# EAGLE board dig_usb (EAGLE 6.6.0)
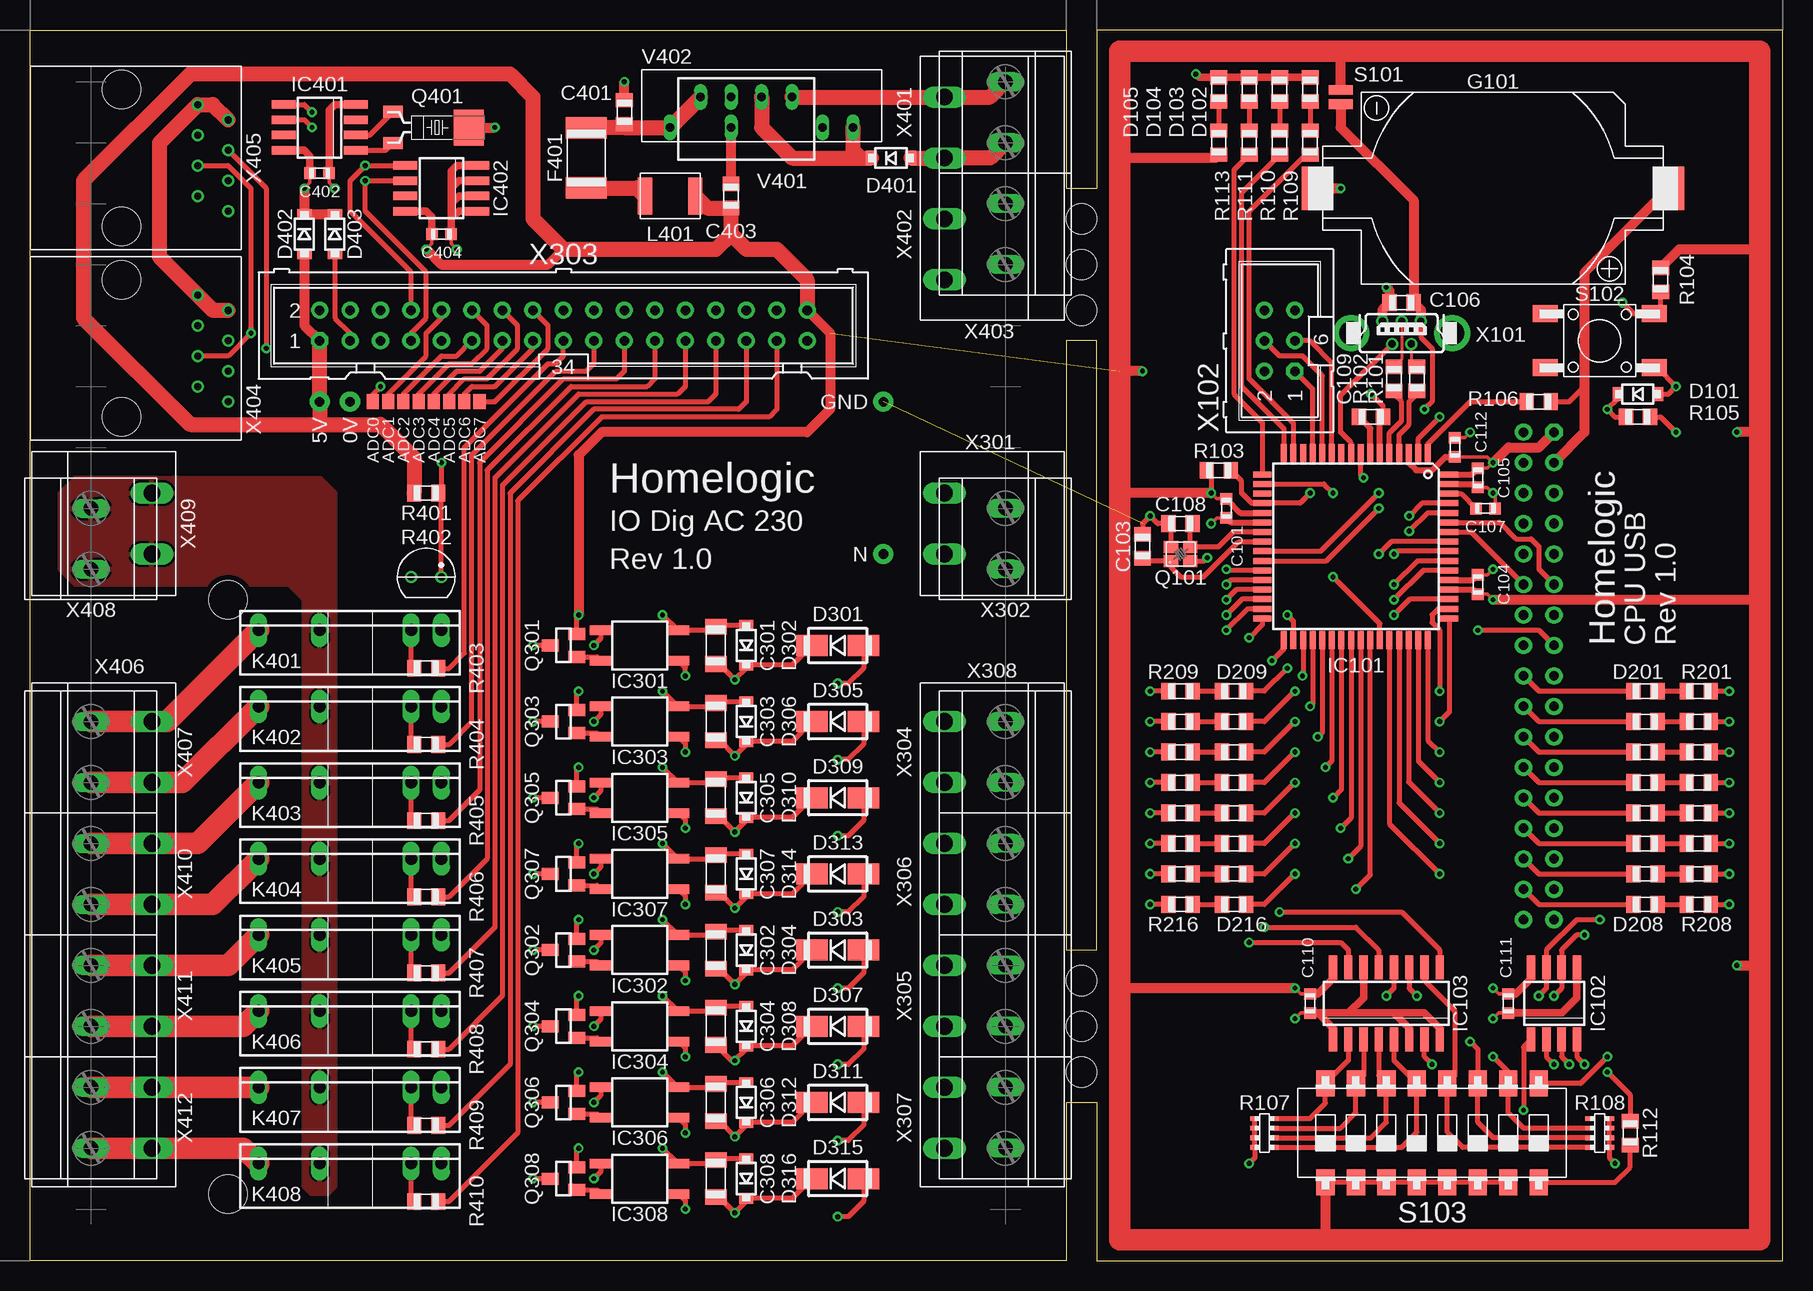
[diagram p4: board, top side]
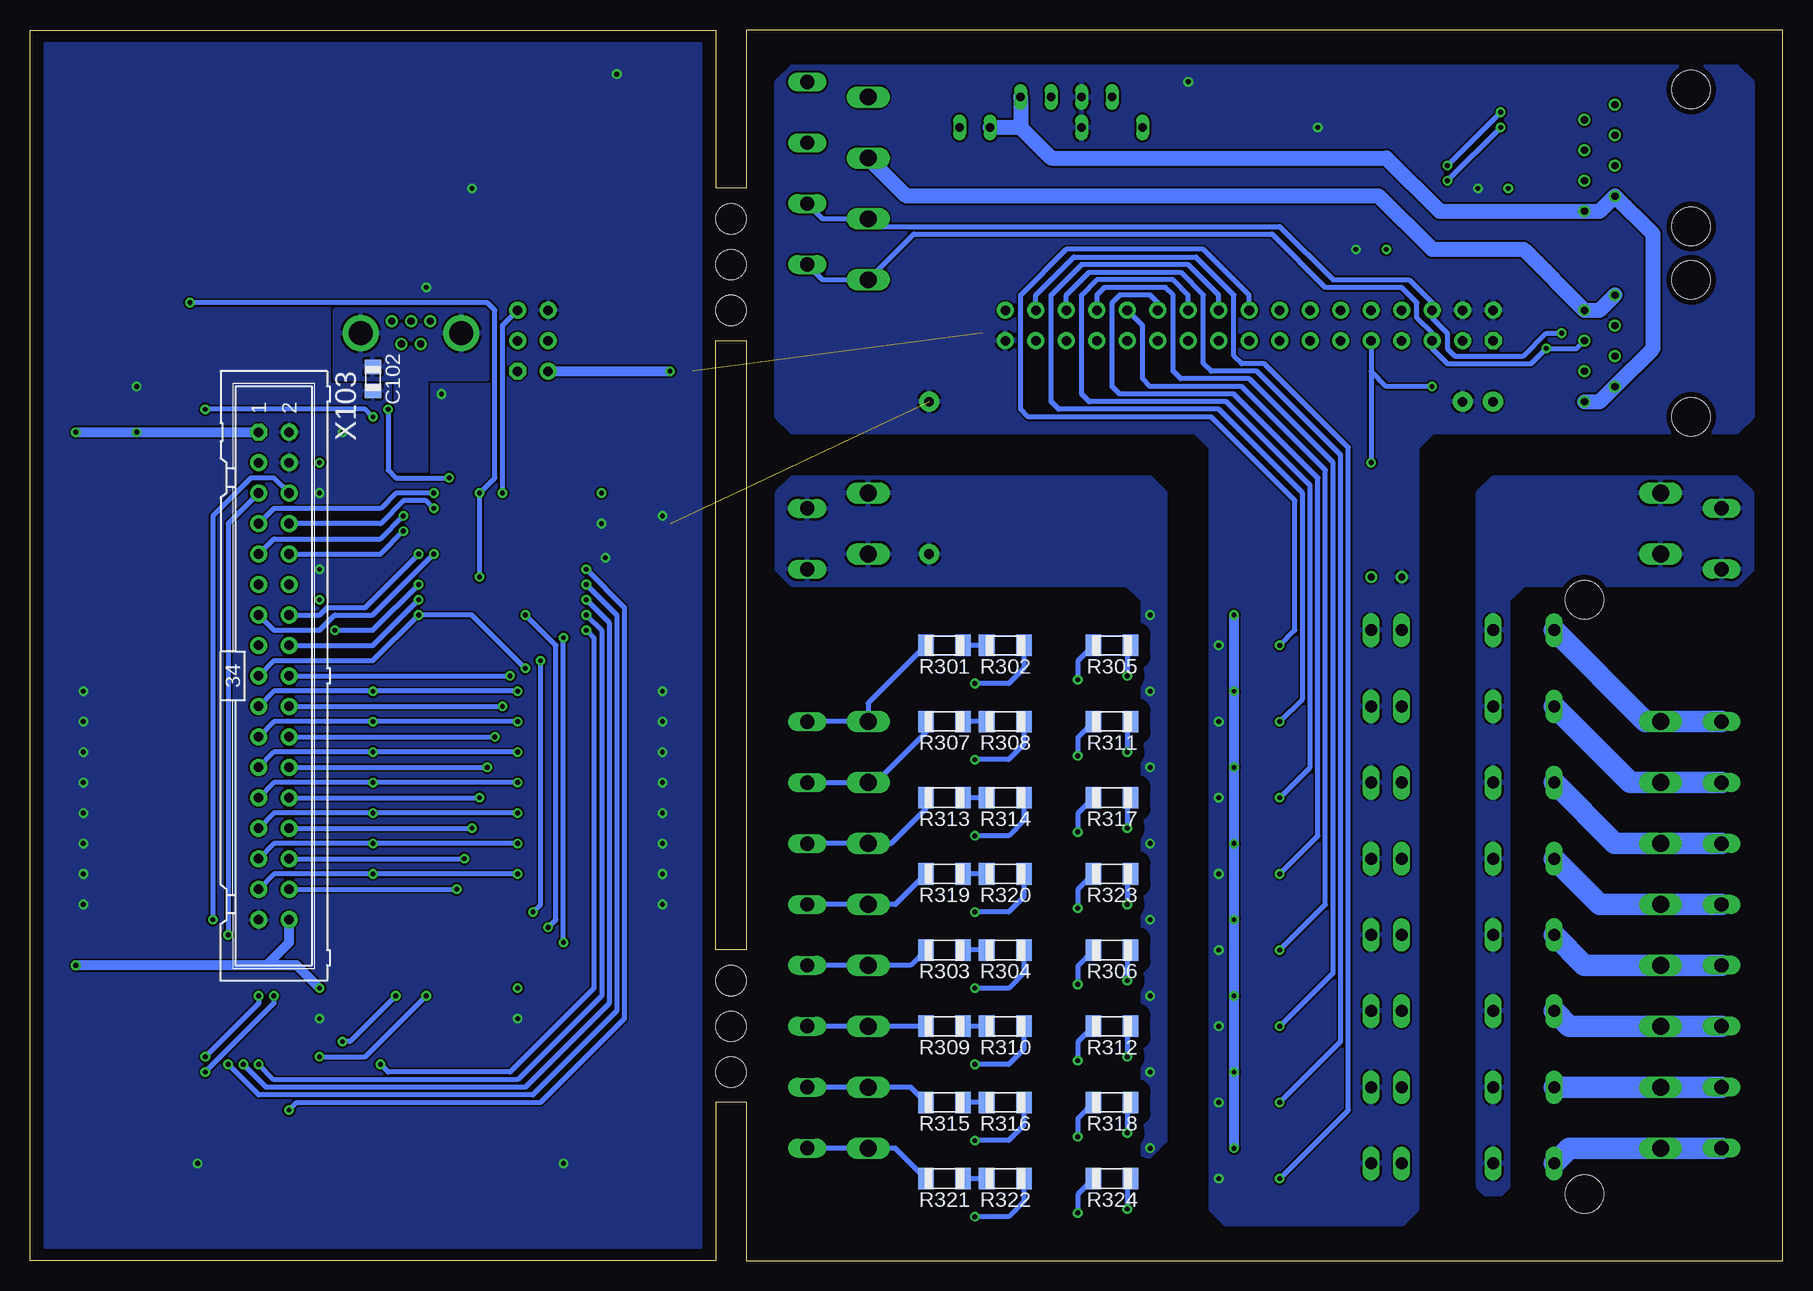
[diagram p5: board, bottom side, seen from below]

Size 146.05 x 102.62 mm. Coordinates in mm from the lower left corner, seen from the top.
Outline: 0,0 0,102.62 86.36,102.62 86.36,89.41 88.9,89.41 88.9,102.62 146.05,102.62 146.05,0 88.9,0 88.9,13.21 86.36,13.21 86.36,0 0,0
Copper layers (1*16): Top 0.018mm / dielectric 1.55mm / Bottom 0.018mm
Design rules "eC-PCB_proto-2-layer *": minimum track width 0.15mm, minimum drill 0.25mm, track to track 0.15mm, track to pad 0.15mm, pad to pad 0.15mm, via to via 0.15mm, smd to smd 0.15mm, copper to edge 0.45mm, drill to drill 0.3mm, minimum pad ring 0.2mm, minimum via ring 0.2mm, stop-mask expansion 0.1mm, vias tented up to drill 0.5mm, thermal gap 0.2mm
Net classes: 1 netz: clearance 3 mm to class 0, clearance 1 mm; 2 buspower: clearance 0.5 mm to class 0, clearance 3 mm to class 1, clearance 0.5 mm
Holes 2.5 mm at 87.63,15.75 87.63,19.56 87.63,23.37 87.63,86.87 87.63,83.06 87.63,79.25
Holes 3.2 mm at 16.51,5.59 16.51,55.12
tKeepout: area 12.7,0 to 14,102.6; area 72.4,0 to 73.7,102.6; area 88.9,0 to 97.8,102.6; area 88.9,0 to 146.1,3; area 88.9,99.6 to 146.1,102.6; area 137.2,0 to 146.1,102.6
bKeepout: area 0,0 to 86.4,3; area 0,99.6 to 86.4,102.6; area 0,0 to 2.5,102.6; area 83.8,0 to 86.4,102.6; area 88.9,99.6 to 146.1,102.6; area 88.9,0 to 146.1,3
Milling: area 86.4,25.9 to 88.9,76.7

## Footprints (pad centres in the part's own frame; a part is rotated, then mirrored left to right if it is on the bottom)
VIA08 = drill 0.8 pad 1.676: 1 0,0
PADS = smd 1.27 x 1.016: 1 0,0
CHIP_0603 = smd 0.95 x 1: 1 -0.8,0; 2 0.8,0
CHIP_0805 = smd 1.2 x 1.4: 1 -1,0; 2 1,0
CHIP_1206 = smd 1.3 x 1.8: 1 -1.55,0; 2 1.55,0
SOD123 = smd 0.9 x 1.2: A 1.65,0; K -1.65,0
DO214AC = smd 2.65 x 1.75: A 2.15,0; K -2.15,0
CHIP_1812 = smd 1.8 x 3.4: 1 -2.5,0; 2 2.5,0
KHZ20SMD-2 = smd 2.6 x 3.6: + 14.65,0; - -14.65,0
QFP64_08 = smd 1.5 x 0.5: 1 -7.8,6; 2 -7.8,5.2; 3 -7.8,4.4; 4 -7.8,3.6; 5 -7.8,2.8; 6 -7.8,2; 7 -7.8,1.2; 8 -7.8,0.4; 9 -7.8,-0.4; 10 -7.8,-1.2; 11 -7.8,-2; 12 -7.8,-2.8; 13 -7.8,-3.6; 14 -7.8,-4.4; 15 -7.8,-5.2; 16 -7.8,-6; 33 7.8,-6; 34 7.8,-5.2; 35 7.8,-4.4; 36 7.8,-3.6; 37 7.8,-2.8; 38 7.8,-2; 39 7.8,-1.2; 40 7.8,-0.4; 41 7.8,0.4; 42 7.8,1.2; 43 7.8,2; 44 7.8,2.8; 45 7.8,3.6; 46 7.8,4.4; 47 7.8,5.2; 48 7.8,6 | smd 0.5 x 1.5: 17 -6,-7.8; 18 -5.2,-7.8; 19 -4.4,-7.8; 20 -3.6,-7.8; 21 -2.8,-7.8; 22 -2,-7.8; 23 -1.2,-7.8; 24 -0.4,-7.8; 25 0.4,-7.8; 26 1.2,-7.8; 27 2,-7.8; 28 2.8,-7.8; 29 3.6,-7.8; 30 4.4,-7.8; 31 5.2,-7.8; 32 6,-7.8; 49 6,7.8; 50 5.2,7.8; 51 4.4,7.8; 52 3.6,7.8; 53 2.8,7.8; 54 2,7.8; 55 1.2,7.8; 56 0.4,7.8; 57 -0.4,7.8; 58 -1.2,7.8; 59 -2,7.8; 60 -2.8,7.8; 61 -3.6,7.8; 62 -4.4,7.8; 63 -5.2,7.8; 64 -6,7.8
SOP08_127 = smd 0.7 x 2: 1 -1.905,-3; 2 -0.635,-3; 3 0.635,-3; 4 1.905,-3; 5 1.905,3; 6 0.635,3; 7 -0.635,3; 8 -1.905,3
SOP16_127 = smd 0.7 x 2: 1 -4.445,-3; 2 -3.175,-3; 3 -1.905,-3; 4 -0.635,-3; 5 0.635,-3; 6 1.905,-3; 7 3.175,-3; 8 4.445,-3; 9 4.445,3; 10 3.175,3; 11 1.905,3; 12 0.635,3; 13 -0.635,3; 14 -1.905,3; 15 -3.175,3; 16 -4.445,3
SOP04_254 = smd 0.8 x 1.8: 1 -1.27,-3.25; 2 1.27,-3.25; 3 1.27,3.25; 4 -1.27,3.25
SIP4 = drill 1 long: 1 -7.62,0; 2 -2.54,0; 3 5.08,0; 4 7.62,0
1812AF = smd 1.2 x 3.1: 1 -2.1,0; 2 2.1,0
X22 = smd 1.2 x 1: 1 -0.8,-0.6; 2 0.8,-0.6; 3 0.8,0.6; 4 -0.8,0.6
SOT23 = smd 1 x 1.4: 1 -0.95,-1.1; 2 0.95,-1.1; 3 0,1.1
MS1V-T1K = smd 1 x 1.6: 1 -1.3,-1.5; 2 1.3,-1.5 | smd 3 x 2.5: G 0,4.8
1206 = smd 0.4 x 0.8: 1A -1.2,-0.8; 1B -1.2,0.8; 2A -0.4,-0.8; 2B -0.4,0.8; 3A 0.4,-0.8; 3B 0.4,0.8; 4A 1.2,-0.8; 4B 1.2,0.8
TO92 = drill 0.6: 1 1.27,0; 2 -1.27,0
JUMPER2 = smd 0.8 x 2: P$1 -0.6,0; P$2 0.6,0
SCHURTER1301 = smd 2.1 x 1.4: 1 4.55,-2.25; 2 -4.55,-2.25; 3 4.55,2.25; 4 -4.55,2.25
DIP08_SMD = smd 1.524 x 2.159: 13 -8.89,-4.128; 14 -8.89,4.128; 23 -6.35,-4.128; 24 -6.35,4.128; 33 -3.81,-4.128; 34 -3.81,4.128; 43 -1.27,-4.128; 44 -1.27,4.128; 53 1.27,-4.128; 54 1.27,4.128; 63 3.81,-4.128; 64 3.81,4.128; 73 6.35,-4.128; 74 6.35,4.128; 83 8.89,-4.128; 84 8.89,4.128
TME-24V = drill 0.7 pad 1.1 long: 1 -3.81,0; 2 -1.27,0; 3 1.27,0; 4 3.81,0
MEV1S = drill 0.7 long: 1 7.62,0; 2 5.08,0; 5 -2.54,0; 7 -7.62,0
WE651005136421 = drill 0.6: 1 -1.6,-1; 2 -0.8,0.9; 3 0,-1; 4 0.8,0.9; 5 1.6,-1 | drill 2 pad 3: S1 -4.2,0; S2 4.2,0
ML6 = drill 0.8 pad 1.422: GND 2.54,1.27; MOSI 0,1.27; RESET 2.54,-1.27; SCK 0,-1.27; VCC -2.54,1.27 | drill 0.8 pad 1.422 octagon: MISO -2.54,-1.27
WS34V = drill 0.8 pad 1.422 octagon: 1 -20.32,-1.27 | drill 0.8 pad 1.422: 2 -20.32,1.27; 3 -17.78,-1.27; 4 -17.78,1.27; 5 -15.24,-1.27; 6 -15.24,1.27; 7 -12.7,-1.27; 8 -12.7,1.27; 9 -10.16,-1.27; 10 -10.16,1.27; 11 -7.62,-1.27; 12 -7.62,1.27; 13 -5.08,-1.27; 14 -5.08,1.27; 15 -2.54,-1.27; 16 -2.54,1.27; 17 0,-1.27; 18 0,1.27; 19 2.54,-1.27; 20 2.54,1.27; 21 5.08,-1.27; 22 5.08,1.27; 23 7.62,-1.27; 24 7.62,1.27; 25 10.16,-1.27; 26 10.16,1.27; 27 12.7,-1.27; 28 12.7,1.27; 29 15.24,-1.27; 30 15.24,1.27; 31 17.78,-1.27; 32 17.78,1.27; 33 20.32,-1.27; 34 20.32,1.27
AKL_230-02 = drill 1.4 long: P$1 -2.54,0; P$2 2.54,0
RIA-73-02 = drill 1.2 long: 1 -2.54,0; 2 2.54,0
AKL_230-08 = drill 1.4 long: P$1 -17.78,0; P$2 -12.7,0; P$3 -7.62,0; P$4 -2.54,0; P$5 2.54,0; P$6 7.62,0; P$7 12.7,0; P$8 17.78,0
AKL_230-04 = drill 1.4 long: P$1 -7.62,0; P$2 -2.54,0; P$3 2.54,0; P$4 7.62,0
C-BMJ-0102 = drill 0.6: P$1 -4.445,6.35; P$2 -3.175,8.89; P$3 -1.905,6.35; P$4 -0.635,8.89; P$5 0.635,6.35; P$6 1.905,8.89; P$7 3.175,6.35; P$8 4.445,8.89 | hole 3.2: -5.715,0; 5.715,0

## Placement (x,y rotation side)
0V  [VIA08]  26.67,71.63 90 top
5V  [VIA08]  24.13,71.63 90 top
ADC0  [PADS]  28.57,71.63 90 top
ADC1  [PADS]  29.84,71.63 90 top
ADC2  [PADS]  31.11,71.63 90 top
ADC3  [PADS]  32.38,71.63 90 top
ADC4  [PADS]  33.66,71.63 90 top
ADC5  [PADS]  34.92,71.63 90 top
ADC6  [PADS]  36.2,71.63 90 top
ADC7  [PADS]  37.47,71.63 90 top
C101  100nF  [CHIP_0603]  99.69,62.74 270 top
C102  100nF  [CHIP_0805]  117.47,73.53 270 bottom
C103  15pF  [CHIP_0805]  92.71,59.56 90 top
C104  100nF  [CHIP_0603]  120.65,56.39 90 top
C105  100nF  [CHIP_0603]  120.65,65.28 270 top
C106  10μF  [CHIP_0805]  114.3,79.88 180 top
C107  100nF  [CHIP_0603]  121.28,62.74 0 top
C108  15pF  [CHIP_0805]  95.89,61.47 180 top
C109  1μF  [CHIP_0805]  111.76,70.36 0 top
C110  100nF  [CHIP_0603]  106.68,21.46 270 top
C111  100nF  [CHIP_0603]  123.19,21.46 270 top
C112  100nF  [CHIP_0603]  118.75,67.82 90 top
C301  1μF  [CHIP_1206]  57.15,51.31 90 top
C302  1μF  [CHIP_1206]  57.15,25.91 90 top
C303  1μF  [CHIP_1206]  57.15,44.96 90 top
C304  1μF  [CHIP_1206]  57.15,19.56 90 top
C305  1μF  [CHIP_1206]  57.15,38.61 90 top
C306  1μF  [CHIP_1206]  57.15,13.21 90 top
C307  1μF  [CHIP_1206]  57.15,32.26 90 top
C308  1μF  [CHIP_1206]  57.15,6.86 90 top
C401  1μF  [CHIP_0805]  49.53,95.76 90 top
C402  100nF  [CHIP_0603]  24.13,90.68 0 top
C403  4,7μF  [CHIP_0805]  58.42,88.77 90 top
C404  100nF  [CHIP_0603]  34.29,85.6 0 top
D101  MMSZ5222BT1  [SOD123]  133.99,72.26 0 top
D102  GN  [CHIP_0805]  106.68,97.66 90 top
D103  GE  [CHIP_0805]  104.14,97.66 90 top
D104  RT  [CHIP_0805]  101.6,97.66 90 top
D105  GN  [CHIP_0805]  99.06,97.66 90 top
D201  GN  [CHIP_0805]  134.62,47.5 0 top
D202  GN  [CHIP_0805]  134.62,44.96 0 top
D203  GN  [CHIP_0805]  134.62,42.42 0 top
D204  GN  [CHIP_0805]  134.62,39.88 0 top
D205  GN  [CHIP_0805]  134.62,37.34 0 top
D206  GN  [CHIP_0805]  134.62,34.8 0 top
D207  GN  [CHIP_0805]  134.62,32.26 0 top
D208  GN  [CHIP_0805]  134.62,29.72 0 top
D209  GN  [CHIP_0805]  100.33,47.5 180 top
D210  GN  [CHIP_0805]  100.33,44.96 180 top
D211  GN  [CHIP_0805]  100.33,42.42 180 top
D212  GN  [CHIP_0805]  100.33,39.88 180 top
D213  GN  [CHIP_0805]  100.33,37.34 180 top
D214  GN  [CHIP_0805]  100.33,34.8 180 top
D215  GN  [CHIP_0805]  100.33,32.26 180 top
D216  GN  [CHIP_0805]  100.33,29.72 180 top
D301  MRA4007  [DO214AC]  67.31,51.31 0 top
D302  91V  [SOD123]  59.69,51.31 90 top
D303  MRA4007  [DO214AC]  67.31,25.91 0 top
D304  91V  [SOD123]  59.69,25.91 90 top
D305  MRA4007  [DO214AC]  67.31,44.96 0 top
D306  91V  [SOD123]  59.69,44.96 90 top
D307  MRA4007  [DO214AC]  67.31,19.56 0 top
D308  91V  [SOD123]  59.69,19.56 90 top
D309  MRA4007  [DO214AC]  67.31,38.61 0 top
D310  91V  [SOD123]  59.69,38.61 90 top
D311  MRA4007  [DO214AC]  67.31,13.21 0 top
D312  91V  [SOD123]  59.69,13.21 90 top
D313  MRA4007  [DO214AC]  67.31,32.26 0 top
D314  91V  [SOD123]  59.69,32.26 90 top
D315  MRA4007  [DO214AC]  67.31,6.86 0 top
D316  91V  [SOD123]  59.69,6.86 90 top
D401  SD103  [SOD123]  71.75,91.95 0 top
D402  1N4148  [SOD123]  22.86,85.6 270 top
D403  1N4148  [SOD123]  25.4,85.6 270 top
F401  194600-020  [CHIP_1812]  46.35,91.95 90 top
G101  KZH20SMD-2  [KHZ20SMD-2]  121.92,89.41 0 top
GND  [VIA08]  71.12,71.63 0 top
IC101  AT90USB1287-AU  [QFP64_08]  110.49,59.56 270 top
IC102  MAX487CSA  [SOP08_127]  127,21.46 0 top
IC103  74HC166D  [SOP16_127]  113.03,21.46 0 top
IC301  LTV-356T  [SOP04_254]  50.8,51.31 90 top
IC302  LTV-356T  [SOP04_254]  50.8,25.91 90 top
IC303  LTV-356T  [SOP04_254]  50.8,44.96 90 top
IC304  LTV-356T  [SOP04_254]  50.8,19.56 90 top
IC305  LTV-356T  [SOP04_254]  50.8,38.61 90 top
IC306  LTV-356T  [SOP04_254]  50.8,13.21 90 top
IC307  LTV-356T  [SOP04_254]  50.8,32.26 90 top
IC308  LTV-356T  [SOP04_254]  50.8,6.86 90 top
IC401  DS1337S  [SOP08_127]  24.13,94.49 90 top
IC402  M24C01WMN  [SOP08_127]  34.29,89.41 90 top
K401  S202S02  [SIP4]  26.67,52.58 0 top
K402  S202S02  [SIP4]  26.67,46.23 0 top
K403  S202S02  [SIP4]  26.67,39.88 0 top
K404  S202S02  [SIP4]  26.67,33.53 0 top
K405  S202S02  [SIP4]  26.67,27.18 0 top
K406  S202S02  [SIP4]  26.67,20.83 0 top
K407  S202S02  [SIP4]  26.67,14.48 0 top
K408  S202S02  [SIP4]  26.67,8.13 0 top
L401  10μH  [1812AF]  53.34,88.77 180 top
N  [VIA08]  71.12,58.93 0 top
Q101  16MHz  [X22]  95.89,58.93 0 top
Q301  BCR191  [SOT23]  44.45,51.31 90 top
Q302  BCR191  [SOT23]  44.45,25.91 90 top
Q303  BCR191  [SOT23]  44.45,44.96 90 top
Q304  BCR191  [SOT23]  44.45,19.56 90 top
Q305  BCR191  [SOT23]  44.45,38.61 90 top
Q306  BCR191  [SOT23]  44.45,13.21 90 top
Q307  BCR191  [SOT23]  44.45,32.26 90 top
Q308  BCR191  [SOT23]  44.45,6.86 90 top
Q401  32,768kHz  [MS1V-T1K]  31.75,94.49 270 top
R101  22Ω  [CHIP_0805]  115.57,73.53 270 top
R102  22Ω  [CHIP_0805]  113.67,73.53 270 top
R103  10k  [CHIP_0805]  99.06,65.91 180 top
R104  10kΩ  [CHIP_0805]  135.89,81.79 90 top
R105  10kΩ  [CHIP_0805]  133.99,70.36 0 top
R106  1MΩ  [CHIP_0805]  125.73,71.63 180 top
R107  22kΩ  [1206]  102.87,10.67 270 top
R108  22kΩ  [1206]  130.81,10.67 90 top
R109  1,5kΩ  [CHIP_0805]  106.68,93.22 270 top
R110  1,5kΩ  [CHIP_0805]  104.14,93.22 270 top
R111  1,5kΩ  [CHIP_0805]  101.6,93.22 270 top
R112  120Ω  [CHIP_0805]  133.35,10.67 270 top
R113  1,5kΩ  [CHIP_0805]  99.06,93.22 270 top
R201  1,5kΩ  [CHIP_0805]  139.06,47.5 180 top
R202  1,5kΩ  [CHIP_0805]  139.06,44.96 180 top
R203  1,5kΩ  [CHIP_0805]  139.06,42.42 180 top
R204  1,5kΩ  [CHIP_0805]  139.06,39.88 180 top
R205  1,5kΩ  [CHIP_0805]  139.06,37.34 180 top
R206  1,5kΩ  [CHIP_0805]  139.06,34.8 180 top
R207  1,5kΩ  [CHIP_0805]  139.06,32.26 180 top
R208  1,5kΩ  [CHIP_0805]  139.06,29.72 180 top
R209  1,5kΩ  [CHIP_0805]  95.89,47.5 0 top
R210  1,5kΩ  [CHIP_0805]  95.89,44.96 0 top
R211  1,5kΩ  [CHIP_0805]  95.89,42.42 0 top
R212  1,5kΩ  [CHIP_0805]  95.89,39.88 0 top
R213  1,5kΩ  [CHIP_0805]  95.89,37.34 0 top
R214  1,5kΩ  [CHIP_0805]  95.89,34.8 0 top
R215  1,5kΩ  [CHIP_0805]  95.89,32.26 0 top
R216  1,5kΩ  [CHIP_0805]  95.89,29.72 0 top
R301  47kΩ  [CHIP_1206]  69.85,51.31 180 bottom
R302  47kΩ  [CHIP_1206]  64.77,51.31 180 bottom
R303  47kΩ  [CHIP_1206]  69.85,25.91 180 bottom
R304  47kΩ  [CHIP_1206]  64.77,25.91 180 bottom
R305  47kΩ  [CHIP_1206]  55.88,51.31 180 bottom
R306  47kΩ  [CHIP_1206]  55.88,25.91 180 bottom
R307  47kΩ  [CHIP_1206]  69.85,44.96 180 bottom
R308  47kΩ  [CHIP_1206]  64.77,44.96 180 bottom
R309  47kΩ  [CHIP_1206]  69.85,19.56 180 bottom
R310  47kΩ  [CHIP_1206]  64.77,19.56 180 bottom
R311  47kΩ  [CHIP_1206]  55.88,44.96 180 bottom
R312  47kΩ  [CHIP_1206]  55.88,19.56 180 bottom
R313  47kΩ  [CHIP_1206]  69.85,38.61 180 bottom
R314  47kΩ  [CHIP_1206]  64.77,38.61 180 bottom
R315  47kΩ  [CHIP_1206]  69.85,13.21 180 bottom
R316  47kΩ  [CHIP_1206]  64.77,13.21 180 bottom
R317  47kΩ  [CHIP_1206]  55.88,38.61 180 bottom
R318  47kΩ  [CHIP_1206]  55.88,13.21 180 bottom
R319  47kΩ  [CHIP_1206]  69.85,32.26 180 bottom
R320  47kΩ  [CHIP_1206]  64.77,32.26 180 bottom
R321  47kΩ  [CHIP_1206]  69.85,6.86 180 bottom
R322  47kΩ  [CHIP_1206]  64.77,6.86 180 bottom
R323  47kΩ  [CHIP_1206]  55.88,32.26 180 bottom
R324  47kΩ  [CHIP_1206]  55.88,6.86 180 bottom
R401  3,3kΩ  [CHIP_0805]  33.02,64.01 180 top
R402  KTY81-210  [TO92]  33.02,57.02 0 top
R403  470Ω  [CHIP_0805]  33.02,49.4 180 top
R404  470Ω  [CHIP_0805]  33.02,43.05 180 top
R405  470Ω  [CHIP_0805]  33.02,36.7 180 top
R406  470Ω  [CHIP_0805]  33.02,30.35 180 top
R407  470Ω  [CHIP_0805]  33.02,24 180 top
R408  470Ω  [CHIP_0805]  33.02,17.65 180 top
R409  470Ω  [CHIP_0805]  33.02,11.3 180 top
R410  470Ω  [CHIP_0805]  33.02,4.95 180 top
S101  [JUMPER2]  109.22,97.03 270 top
S102  [SCHURTER1301]  130.81,76.71 0 top
S103  [DIP08_SMD]  116.84,10.67 0 top
V401  TME2405S  [TME-24V]  59.69,97.03 180 top
V402  MEV1S2405  [MEV1S]  60.96,94.49 0 top
X101  [WE651005136421]  114.3,77.34 180 top
X102  ISP  [ML6]  104.14,76.71 90 top
X103  [WS34V]  125.73,48.77 270 bottom
X301  [AKL_230-02]  76.2,61.47 90 top
X302  [RIA-73-02]  81.28,60.2 90 top
X303  [WS34V]  44.45,77.98 0 top
X304  [RIA-73-02]  81.28,42.42 90 top
X305  [RIA-73-02]  81.28,22.1 90 top
X306  [RIA-73-02]  81.28,32.26 90 top
X307  [RIA-73-02]  81.28,11.94 90 top
X308  AKL_230-08  [AKL_230-08]  76.2,27.18 90 top
X401  [RIA-73-02]  81.28,95.76 90 top
X402  [RIA-73-02]  81.28,85.6 90 top
X403  [AKL_230-04]  76.2,89.41 90 top
X404  [C-BMJ-0102]  7.62,76.07 270 top
X405  [C-BMJ-0102]  7.62,91.95 270 top
X406  AKL_230-08  [AKL_230-08]  10.16,27.18 270 top
X407  [RIA-73-02]  5.08,42.42 270 top
X408  [RIA-73-02]  5.08,60.2 270 top
X409  [AKL_230-02]  10.16,61.47 270 top
X410  [RIA-73-02]  5.08,32.26 270 top
X411  [RIA-73-02]  5.08,22.1 270 top
X412  [RIA-73-02]  5.08,11.94 270 top

## Tracks (layer width: path | path; a pad name or v marks a point on that pad's centre or on a via)
!R  (via drill 0.4)
  Top 0.406: IC101.33 104.49,51.02 v103.5,50.04 | v104.14,29.08 114.3,29.08 117.47,25.91 IC103.9
  Bottom 0.406: v104.14,29.08 103.5,29.72 v103.5,50.04
!RESET  (via drill 0.4)
  Top 0.406: R103.1 100.97,65.01 100.97,64.01 101.81,63.16 IC101.20 105.83,63.16 v106.68,64.01
  Bottom 0.406: X102.RESET 106.68,77.98 v106.68,64.01
+5V  (via drill 0.4)  (1 unrouted)
  Top 0.305: C104.1 121.45,55.59 v121.92,55.12 | C101.1 98.89,63.54 v98.42,64.01 | C110.1 105.88,22.26 v105.41,22.73 | v121.92,22.73 122.39,22.26 C111.1 | C105.1 121.45,66.08 v121.92,66.55 121.45,67.02 C112.1 | C404.1 33.49,84.8 v33.02,84.33
  Top 0.406: S103.73 S103.63 S103.53 S103.43 S103.33 S103.23 S103.13 | R103.2 98.42,65.55 v98.42,64.01 | 91.28,93.05 90.81,92.58 | R113.2 98.79,91.95 | Q301.2 45.55,53.68 v45.72,53.85 | Q303.2 45.55,47.33 v45.72,47.5 | Q305.2 45.55,40.98 v45.72,41.15 | Q307.2 45.55,34.63 v45.72,34.8 | Q302.2 45.55,28.28 v45.72,28.45 | Q304.2 45.55,21.93 v45.72,22.1 | Q306.2 45.55,15.58 v45.72,15.75 | Q308.2 45.55,9.23 v45.72,9.4 | R105.2 135.89,70.36 v137.16,69.09
  Top 0.508: IC101.52 120.28,55.96 C104.1 | IC101.64 120.14,65.56 C105.1 | C101.1 100.87,62.36 IC101.21 | IC101.3 114.89,66.53 115.51,65.91 116.84,65.91 117.94,67.02 C112.1
  Top 0.61: C110.1 107.31,22.26 108.58,23.53 IC103.16 | C111.1 123.83,22.26 125.09,23.53 IC102.8 | IC402.8 33.02,87.5 33.49,87.03 C404.1
  Top 0.813: S103.13 107.95,1.78 | v105.41,22.73 90.81,22.73 | v142.24,24.64 144.15,24.64 | v98.42,64.01 90.81,64.01 | v92.71,74.17 90.81,74.17 | v121.92,66.55 123.19,67.82 125.73,67.82 X103.1 | 144.15,69.09 v142.24,69.09 | v121.92,55.12 144.15,55.12 | 98.79,91.95 90.81,91.95 | D402.A 22.86,77.98 X303.1 | X303.34 66.67,77.34 66.67,70.99 64.77,69.09 47.62,69.09 45.72,67.18 v45.72,53.85 | R104.2 137.43,84.33 144.15,84.33 | S101.P$1 109.22,100.84 | v33.02,84.33 34.29,83.06 43.18,83.06 44.13,84.01 44.13,84.65
  Top 1.27: 24.13,69.72 13.34,69.72 4.45,78.61 4.45,90.04 13.34,98.93 40.01,98.93 41.91,97.03 41.91,86.87 44.13,84.65 44.45,84.33 57.15,84.33 58.42,85.6 | 24.13,69.72 29.21,69.72 32.02,66.91 R401.2 | X303.1 5V.1 24.13,69.72 | L401.1 56.44,87.77 C403.1 58.42,85.6 | 58.42,85.6 59.69,84.33 62.23,84.33 64.77,81.79 X303.34
  Top 1.778: 90.81,100.84 109.22,100.84 144.15,100.84 144.15,84.33 144.15,69.09 144.15,55.12 144.15,24.64 144.15,1.78 107.95,1.78 90.81,1.78 90.81,22.73 90.81,64.01 90.81,74.17 90.81,91.95 90.81,92.58 90.81,100.84
  Bottom 0.813: v121.92,22.73 123.83,24.64 126.36,24.64 | 126.36,24.64 v142.24,24.64 | 126.36,24.64 124.46,26.54 X103.34 | X102.VCC v92.71,74.17 | v142.24,69.09 v137.16,69.09 X103.1 | v45.72,53.85 v45.72,47.5 v45.72,41.15 v45.72,34.8 v45.72,28.45 v45.72,22.1 v45.72,15.75 v45.72,9.4
C1  (via drill 0.4)
  Top 0.406: v116.84,16.38 116.2,17.02 IC103.7 | IC101.31 101.48,54.36 v99.69,52.58
  Bottom 0.406: v99.69,52.58 99.06,51.94 99.06,22.73 106.05,15.75 116.2,15.75 v116.84,16.38
C2  (via drill 0.4)
  Top 0.406: IC101.32 102.69,53.03 v101.6,51.94 | v101.6,26.54 109.22,26.54 109.86,25.91 IC103.15
  Bottom 0.406: v101.6,26.54 v101.6,51.94
DI  (via drill 0.4)
  Top 0.406: v104.78,53.85 105.29,53.33 IC101.34 | v102.87,27.81 110.49,27.81 112.39,25.91 IC103.13
  Bottom 0.406: v102.87,27.81 102.23,28.45 102.23,51.31 v104.78,53.85
GND  (via drill 0.4)  (1 unrouted)
  Top 0.305: C104.2 121.45,57.19 v121.92,57.66 | C110.2 105.88,20.66 v105.41,20.19 | C402.2 24.93,89.88 v25.4,89.41 | v121.92,20.19 122.39,20.66 C111.2 | C105.2 121.45,64.48 v121.92,64.01 122.08,63.84 C107.2 | C101.2 98.89,61.94 v98.42,61.47 | C112.2 119.55,68.62 v120.02,69.09 | C404.2 35.09,84.8 v35.56,84.33
  Top 0.406: R108.4A R108.3A R108.2A R108.1A 131.61,8.6 v132.08,8.13 | R107.1A R107.2A R107.3A R107.4A 102.07,8.6 v101.6,8.13 | C109.2 112.76,71.26 v111.76,72.26 | IC301.3 47.55,51.87 v46.99,51.31 | IC303.3 47.55,45.52 v46.99,44.96 | IC305.3 47.55,39.17 v46.99,38.61 | IC308.3 47.55,7.42 v46.99,6.86 | IC306.3 47.55,13.77 v46.99,13.21 | IC304.3 47.55,20.12 v46.99,19.56 | IC302.3 47.55,26.47 v46.99,25.91 | IC307.3 47.55,32.82 v46.99,32.26 | Q101.2 97.83,58.33 v98.11,58.61 | Q101.4 95.08,61.27 C108.2 93.98,61.47 v93.34,62.1 92.71,61.47 C103.2 | R209.1 v93.34,47.5 | R210.1 v93.34,44.96 | R211.1 v93.34,42.42 | R212.1 v93.34,39.88 | R213.1 v93.34,37.34 | R214.1 v93.34,34.8 | R215.1 v93.34,32.26 | R216.1 v93.34,29.72 | R208.1 v141.6,29.72 | R207.1 v141.6,32.26 | R206.1 v141.6,34.8 | R205.1 v141.6,37.34 | R204.1 v141.6,39.88 | R203.1 v141.6,42.42 | R202.1 v141.6,44.96 | R201.1 v141.6,47.5 | D101.A 136.53,72.26 v137.16,72.9 135.6,74.46 S102.1
  Top 0.508: IC101.53 120.22,56.76 C104.2 | IC101.63 120.36,64.76 C105.2 | IC101.6 112.49,70.09 C109.2 | C101.2 100.07,61.56 IC101.22
  Top 0.61: C110.2 107.31,20.66 | 107.31,20.66 109.86,20.66 | 109.86,20.66 113.67,20.66 | 113.67,20.66 116.2,20.66 117.47,19.39 IC103.8 | IC103.6 114.94,19.39 113.67,20.66 | IC103.1 108.58,19.39 107.31,20.66 | C111.2 127.64,20.66 128.91,21.93 IC102.5 | IC103.14 111.12,21.93 109.86,20.66 | D102.2 D103.2 D104.2 D105.2 97.42,98.66 v97.16,98.93 | 35.09,86.87 35.09,88.14 | 35.09,88.14 35.09,89.41 | 35.09,89.41 35.09,90.84 35.56,91.31 IC402.4 | IC402.1 35.73,87.5 35.09,86.87 | IC402.2 35.73,88.77 35.09,88.14 | IC402.3 35.73,90.04 35.09,89.41 | C402.2 24.93,95.92 25.4,96.39 IC401.4 | 35.09,86.87 C404.2
  Top 0.813: G101.- v109.22,89.41 | Q401.G v38.73,94.49 | v113.03,81.15 113.3,80.88 C106.2 112.7,79.28 X101.5 | C401.2 v49.53,98.3 | C403.2 V402.5
  pour Bottom (rank 6): 90.17,101.47 144.78,101.47 144.78,1.14 90.17,1.14
  pour Bottom: 30.48,67.82 30.48,4.32 31.75,3.05 46.35,3.05 47.62,4.32 47.62,67.82 48.9,69.09 82.55,69.09 83.82,70.36 83.82,98.3 82.55,99.57 3.81,99.57 2.54,98.3 2.54,70.36 3.81,69.09 29.21,69.09
GNDIO  (via drill 0.4)
  Top 0.406: v52.7,47.5 53.98,46.23 IC303.2 56.87,46.23 C303.2 57.25,46.61 D306.A | v52.7,53.85 53.98,52.58 IC301.2 56.87,52.58 C301.2 57.25,52.96 D302.A | v52.7,41.15 53.98,39.88 IC305.2 56.87,39.88 C305.2 57.25,40.26 D310.A | v52.7,34.8 53.98,33.53 IC307.2 56.87,33.53 C307.2 57.25,33.91 D314.A | v52.7,28.45 53.98,27.18 IC302.2 56.87,27.18 C302.2 57.25,27.56 D304.A | v52.7,22.1 53.98,20.83 IC304.2 56.87,20.83 C304.2 57.25,21.21 D308.A | v52.7,15.75 53.98,14.48 IC306.2 56.87,14.48 C306.2 57.25,14.86 D312.A | v52.7,9.4 53.98,8.13 IC308.2 56.87,8.13 C308.2 57.25,8.51 D316.A
  pour Bottom: 53.34,8.76 52.7,8.76 51.44,10.03 51.44,64.01 52.7,65.28 82.55,65.28 83.82,64.01 83.82,57.66 82.55,56.39 54.61,56.39 53.34,55.12
IN0  (via drill 0.4)
  Top 0.406: IC101.35 106.09,48.81 v106.05,48.77 | X103.18 125.73,47.5 D201.1
  Bottom 0.406: X103.18 v106.05,48.77
IN1  (via drill 0.4)
  Top 0.406: IC101.36 106.89,46.44 v106.68,46.23 | X103.20 125.73,44.96 D202.1
  Bottom 0.406: X103.20 v106.68,46.23
IN2  (via drill 0.4)
  Top 0.406: IC101.37 107.69,44.06 v107.31,43.69 | X103.22 125.73,42.42 D203.1
  Bottom 0.406: X103.22 v107.31,43.69
IN3  (via drill 0.4)
  Top 0.406: IC101.38 108.49,41.69 v107.95,41.15 | X103.24 125.73,39.88 D204.1
  Bottom 0.406: X103.24 v107.95,41.15
IN4  (via drill 0.4)
  Top 0.406: IC101.39 109.29,39.31 v108.58,38.61 | X103.26 125.73,37.34 D205.1
  Bottom 0.406: X103.26 v108.58,38.61
IN5  (via drill 0.4)
  Top 0.406: IC101.40 110.09,36.94 v109.22,36.07 | X103.28 125.73,34.8 D206.1
  Bottom 0.406: X103.28 v109.22,36.07
IN6  (via drill 0.4)
  Top 0.406: IC101.41 110.89,34.56 v109.86,33.53 | X103.30 125.73,32.26 D207.1
  Bottom 0.406: X103.30 v109.86,33.53
IN7  (via drill 0.4)
  Top 0.406: IC101.42 111.69,32.19 v110.49,30.99 | X103.32 125.73,29.72 D208.1
  Bottom 0.406: X103.32 v110.49,30.99
L
  pour Bottom: 24.77,5.59 23.5,5.59 22.86,6.22 22.86,55.12 21.59,56.39 3.81,56.39 2.54,57.66 2.54,64.01 3.81,65.28 24.13,65.28 25.4,64.01 25.4,6.22
  pour Top: 24.77,5.59 23.5,5.59 22.86,6.22 22.86,55.12 21.59,56.39 3.81,56.39 2.54,57.66 2.54,64.01 3.81,65.28 24.13,65.28 25.4,64.01 25.4,6.22
LED1
  Top 0.406: IC101.15 105.29,69.84 101.6,73.53 101.6,87.5 106.31,92.22 R109.2
LED2
  Top 0.406: IC101.16 104.49,69.37 100.97,72.9 100.97,89.04 R110.2
LED3
  Top 0.406: IC101.17 102.69,69.9 100.33,72.26 100.33,90.95 R111.2
MISO
  Top 0.406: IC101.13 106.89,72.69 X102.MISO
MOSI
  Top 0.406: IC101.12 107.69,73.79 106.05,75.44 104.14,75.44 X102.MOSI
N$1
  Bottom 0.406: R302.2 R301.1
N$2  (via drill 0.4)
  Top 0.406: D301.A 69.46,49.4 68.19,48.13 v67.31,48.13
  Bottom 0.406: R302.1 63.22,49.4 64.49,48.13 v67.31,48.13
N$3  (via drill 0.4)
  Top 0.406: D301.K 63.51,49.66 D302.K 59.69,49.4 v58.74,48.45 57.43,49.76 C301.1
  Bottom 0.406: R305.2 58.74,50 v58.74,48.45
N$4
  Top 0.406: D104.1 R111.1
N$5  (via drill 0.4)
  Top 0.406: v54.61,48.77 54.61,49.48 IC301.1
  Bottom 0.406: R305.1 54.61,51.03 v54.61,48.77
N$6  (via drill 0.4)
  Top 0.406: D305.A 69.46,43.05 68.19,41.78 v67.31,41.78
  Bottom 0.406: R308.1 63.22,43.05 64.49,41.78 v67.31,41.78
N$7  (via drill 0.4)
  Top 0.406: D305.K 63.51,43.31 D306.K 59.69,43.05 v58.74,42.1 57.43,43.41 C303.1
  Bottom 0.406: R311.2 58.74,43.65 v58.74,42.1
N$8
  Top 0.406: R403.2 31.75,49.67 K401.3
N$9  (via drill 0.4)
  Top 0.406: IC303.1 54.61,43.13 v54.61,42.42
  Bottom 0.406: R311.1 54.61,44.68 v54.61,42.42
N$10  (via drill 0.4)
  Top 0.406: D309.A 69.46,36.7 68.19,35.43 v67.31,35.43
  Bottom 0.406: R314.1 63.22,36.7 64.49,35.43 v67.31,35.43
N$11  (via drill 0.4)
  Top 0.406: D309.K 63.51,36.96 D310.K 59.69,36.7 v58.74,35.75 57.43,37.06 C305.1
  Bottom 0.406: R317.2 58.74,37.3 v58.74,35.75
N$12
  Top 0.406: IC101.62 119.26,63.96 C107.1
N$13  (via drill 0.4)
  Top 0.406: IC305.1 54.61,36.78 v54.61,36.07
  Bottom 0.406: R317.1 54.61,38.33 v54.61,36.07
N$14  (via drill 0.4)
  Top 0.406: D313.A 69.46,30.35 68.19,29.08 v67.31,29.08
  Bottom 0.406: R320.1 63.22,30.35 64.49,29.08 v67.31,29.08
N$15  (via drill 0.4)
  Top 0.406: D313.K 63.51,30.61 D314.K 59.69,30.35 v58.74,29.4 57.43,30.71 C307.1
  Bottom 0.406: R323.2 58.74,30.95 v58.74,29.4
N$16
  Top 0.406: R404.2 31.75,43.32 K402.3
N$17
  Bottom 0.406: R308.2 R307.1
N$18
  Bottom 0.406: R314.2 R313.1
N$19
  Top 1.27: V401.4 V402.7 49.53,94.49 | C401.1 49.53,94.49 | 49.53,94.49 46.4,94.49 F401.2
N$20  (via drill 0.4)
  Top 0.406: v127,22.1 127.64,22.73 IC102.6 127.64,25.91 128.91,27.18 v129.54,27.18 | v131.44,17.02 129.22,14.8 S103.84
  Bottom 0.406: v127,22.1 127,21.46 v131.44,17.02 | X103.5 129.54,61.47 v129.54,27.18
N$21
  Top 0.406: IC101.1 116.49,68.1 120.02,71.63 R106.2
N$22  (via drill 0.4)
  Top 0.406: v125.73,22.1 126.36,22.73 IC102.7 126.36,25.91 128.91,28.45 v130.81,28.45 | v131.44,15.75 133.35,13.84 R112.1
  Bottom 0.406: v125.73,22.1 125.73,21.46 v131.44,15.75 | X103.6 125.73,65.28 127.64,65.28 130.81,62.1 v130.81,28.45
N$23
  Top 1.27: V401.2 60.96,94.49 63.5,91.95 69.22,91.95 | 69.22,91.95 D401.K | V402.1 68.58,92.58 69.22,91.95
N$24
  Top 1.27: F401.1 50.56,89.45 L401.2
N$25
  Top 0.406: R405.2 31.75,36.97 K403.3
N$26
  Top 0.406: R107.1B 106.68,11.87 107.95,13.14 S103.14 109.86,16.7 IC103.2
N$27
  Top 0.406: R107.2B 109.22,11.07 110.49,12.34 S103.24 111.12,15.43 IC103.3
N$28
  Top 0.406: R107.3B 111.76,10.27 113.03,11.54 S103.34 112.39,15.43 IC103.4
N$29
  Top 0.406: R107.4B 114.3,9.47 115.57,10.74 S103.44 113.67,16.7 IC103.5
N$30
  Top 0.406: R108.1B 119.38,9.47 118.11,10.74 S103.54 118.75,15.43 118.75,20.83 116.2,23.37 IC103.10
N$31  (via drill 0.4)
  Top 0.406: R108.2B 121.92,10.27 120.65,11.54 S103.64 120.65,17.65 v120.02,18.29 | IC103.11 114.94,22.73 v115.57,22.1
  Bottom 0.406: v115.57,22.1 119.38,18.29 v120.02,18.29
N$32  (via drill 0.4)
  Top 0.406: R108.3B 124.46,11.07 123.19,12.34 S103.74 123.19,15.75 v121.92,17.02 | IC103.12 113.67,22.73 v113.03,22.1
  Bottom 0.406: v121.92,17.02 118.11,17.02 v113.03,22.1
N$33
  Top 0.406: S103.83 132.08,6.54 133.35,7.81 R112.2
N$34  (via drill 0.4)
  Top 0.406: IC307.1 54.61,30.43 v54.61,29.72
  Bottom 0.406: R323.1 54.61,31.98 v54.61,29.72
N$35  (via drill 0.4)
  Top 0.406: D303.A 69.46,24 68.19,22.73 v67.31,22.73
  Bottom 0.406: R304.1 63.22,24 64.49,22.73 v67.31,22.73
N$36  (via drill 0.4)
  Top 0.406: D303.K 63.51,24.26 D304.K 59.69,24 v58.74,23.05 57.43,24.36 C302.1
  Bottom 0.406: R306.2 58.74,24.6 v58.74,23.05
N$37
  Top 0.406: R406.2 31.75,30.62 K404.3
N$38  (via drill 0.4)
  Top 0.406: IC302.1 54.61,24.08 v54.61,23.37
  Bottom 0.406: R306.1 54.61,25.63 v54.61,23.37
N$39  (via drill 0.4)
  Top 0.406: D307.A 69.46,17.65 68.19,16.38 v67.31,16.38
  Bottom 0.406: R310.1 63.22,17.65 64.49,16.38 v67.31,16.38
N$40  (via drill 0.4)
  Top 0.406: D307.K 63.51,17.91 D308.K 59.69,17.65 v58.74,16.7 58.46,16.7 C304.1
  Bottom 0.406: R312.2 58.74,18.25 v58.74,16.7
N$41
  Top 0.406: ADC1.1 29.84,72.26 33.02,75.44 33.02,77.34 34.29,78.61 X303.10
N$42
  Top 0.406: R407.2 31.75,24.27 K405.3
N$43
  Bottom 0.406: R320.2 R319.1
N$44
  Top 0.406: D105.1 R113.1
N$45
  Bottom 0.406: X304.1 X308.P$7 75.56,39.88 71.4,44.04 R307.2
N$46
  Bottom 0.406: X304.2 X308.P$8 76.2,46.51 R301.2
N$47
  Bottom 0.406: R319.2 73.94,29.72 X308.P$5 X306.1
N$48
  Bottom 0.406: R313.2 71.4,37.69 74.3,34.8 X308.P$6 X306.2
N$49
  Bottom 0.406: R304.2 R303.1
N$50
  Top 0.406: R408.2 31.75,17.92 K406.3
N$51
  Bottom 0.406: R310.2 R309.1
N$52
  Top 0.406: Q307.1 47.23,31.31 IC307.4
N$53
  Bottom 0.406: R316.2 R315.1
N$54
  Bottom 0.406: R322.2 R321.1
N$55  (via drill 0.4)
  Top 0.406: IC304.1 54.61,17.73 v54.61,17.02
  Bottom 0.406: R312.1 54.61,19.28 v54.61,17.02
N$56
  Bottom 0.406: R303.2 72.67,24.64 X308.P$4 X305.2
N$57  (via drill 0.4)
  Top 0.406: D311.A 69.46,11.3 68.19,10.03 v67.31,10.03
  Bottom 0.406: R316.1 63.22,11.3 64.49,10.03 v67.31,10.03
N$58
  Bottom 0.406: R309.2 X308.P$3 X305.1
N$59
  Bottom 0.406: R321.2 73.94,9.4 X308.P$1 X307.1
N$60
  Bottom 0.406: R315.2 72.67,14.48 X308.P$2 X307.2
N$61
  Top 0.406: R409.2 31.75,11.57 K407.3
N$62
  Top 0.406: D102.1 R109.1
N$63
  Top 0.406: D103.1 R110.1
N$64  (via drill 0.4)
  Top 0.305: C402.1 23.33,89.88 v22.86,89.41
  Top 0.61: C402.1 23.33,92.11 22.86,92.58 IC401.8
  Top 0.813: v22.86,89.41 D402.K D403.K
N$65  (via drill 0.4)
  Top 0.406: D311.K 63.51,11.56 D312.K 59.69,11.3 v58.74,10.35 57.43,11.66 C306.1
  Bottom 0.406: R318.2 58.74,11.9 v58.74,10.35
N$66
  Top 0.406: R410.2 31.75,4.95 K408.3
N$67
  Top 0.406: R403.1 34.92,49.4 36.2,50.67 36.2,67.82 43.18,74.8 43.81,74.8 44.45,75.44 X303.17
N$68
  Top 1.778: K401.1 11.43,44.96 X406.P$1 X407.1
  Bottom 1.778: K401.1 11.43,44.96 X406.P$1 X407.1
N$69  (via drill 0.4)
  Top 0.406: IC306.1 54.61,11.38 v54.61,10.67
  Bottom 0.406: R318.1 54.61,12.93 v54.61,10.67
N$70
  Top 0.406: Q305.1 47.23,37.66 IC305.4
N$71  (via drill 0.4)
  Top 0.406: D315.A 69.46,4.95 68.19,3.68 v67.31,3.68
  Bottom 0.406: R322.1 63.22,4.95 64.49,3.68 v67.31,3.68
N$72
  Top 1.778: K402.1 12.7,39.88 X406.P$2 X407.2
  Bottom 1.778: K402.1 12.7,39.88 X406.P$2 X407.2
N$73
  Top 0.406: Q303.1 47.23,44.01 IC303.4
N$74
  Top 1.778: K403.1 13.97,34.8 X406.P$3 X410.1
  Bottom 1.778: K403.1 13.97,34.8 X406.P$3 X410.1
N$75
  Top 0.406: Q301.1 47.23,50.36 IC301.4
N$76
  Top 1.778: K404.1 15.24,29.72 X406.P$4 X410.2
  Bottom 1.778: K404.1 15.24,29.72 X406.P$4 X410.2
N$77  (via drill 0.4)
  Top 0.406: D315.K 63.51,5.21 D316.K 59.69,4.95 v58.74,4 57.43,5.31 C308.1
  Bottom 0.406: R324.2 58.74,5.55 v58.74,4
N$78
  Top 1.778: K405.1 16.51,24.64 X406.P$5 X411.1
  Bottom 1.778: K405.1 16.51,24.64 X406.P$5 X411.1
N$79
  Top 0.406: R404.1 34.92,43.05 36.83,44.96 36.83,67.18 43.81,74.17 46.35,74.17 46.99,74.8 X303.19
N$80
  Top 0.406: Q302.1 47.23,24.96 IC302.4
N$81
  Top 0.406: Q304.1 47.23,18.61 IC304.4
N$82
  Top 1.778: K406.1 17.78,19.56 X406.P$6 X411.2
  Bottom 1.778: K406.1 17.78,19.56 X406.P$6 X411.2
N$83
  Top 0.406: Q306.1 47.23,12.26 IC306.4
N$84
  Top 1.778: K407.1 X406.P$7 X412.1
  Bottom 1.778: K407.1 X406.P$7 X412.1
N$85
  Top 0.406: Q308.1 47.23,5.91 IC308.4
N$86  (via drill 0.4)
  Top 0.406: IC308.1 54.61,5.03 v54.61,4.32
  Bottom 0.406: R324.1 54.61,6.58 v54.61,4.32
N$87
  Top 0.406: R405.1 34.92,36.7 37.47,39.24 37.47,66.55 44.45,73.53 48.9,73.53 49.53,74.17 X303.21
N$88
  Top 0.406: R406.1 34.92,30.35 38.1,33.53 38.1,65.91 45.09,72.9 51.44,72.9 52.07,73.53 X303.23
N$89
  Top 1.778: K408.1 17.78,9.4 X406.P$8 X412.2
  Bottom 1.778: K408.1 17.78,9.4 X406.P$8 X412.2
N$90
  Top 0.406: R407.1 34.92,24 38.73,27.81 38.73,65.28 45.72,72.26 53.98,72.26 54.61,72.9 X303.25
N$91
  Top 0.406: R408.1 34.92,17.65 39.37,22.1 39.37,64.64 46.35,71.63 56.52,71.63 57.15,72.26 X303.27
N$92
  Top 0.406: R409.1 34.92,11.3 40.01,16.38 40.01,64.01 46.99,70.99 59.05,70.99 59.69,71.63 X303.29
N$93
  Top 0.406: R410.1 34.92,4.95 40.64,10.67 40.64,63.37 47.62,70.36 61.59,70.36 62.23,70.99 X303.31
N$94  (via drill 0.4)
  Top 0.406: Q301.3 v41.91,51.31
  Bottom 0.406: v41.91,51.31 40.64,52.58 40.64,63.37 47.62,70.36 62.87,70.36 63.5,70.99 63.5,80.52 59.69,84.33 48.26,84.33 44.45,80.52 X303.18
N$95  (via drill 0.4)
  Top 0.406: Q303.3 v41.91,44.96
  Bottom 0.406: v41.91,44.96 40.01,46.86 40.01,64.01 46.99,70.99 60.33,70.99 60.96,71.63 60.96,80.52 58.42,83.06 49.53,83.06 46.99,80.52 X303.20
N$96  (via drill 0.4)
  Top 0.406: Q305.3 v41.91,38.61
  Bottom 0.406: v41.91,38.61 39.37,41.15 39.37,64.64 46.35,71.63 57.78,71.63 58.42,72.26 58.42,80.52 57.15,81.79 50.8,81.79 49.53,80.52 X303.22
N$97  (via drill 0.4)
  Top 0.406: Q307.3 v41.91,32.26
  Bottom 0.406: v41.91,32.26 38.73,35.43 38.73,65.28 45.72,72.26 55.24,72.26 55.88,72.9 55.88,79.88 55.24,80.52 52.7,80.52 52.07,79.88 X303.24
N$98  (via drill 0.4)
  Top 0.406: Q302.3 v41.91,25.91
  Bottom 0.406: v41.91,25.91 38.1,29.72 38.1,65.91 45.09,72.9 52.7,72.9 53.34,73.53 53.34,77.98 X303.26
N$99  (via drill 0.4)
  Top 0.406: Q304.3 v41.91,19.56
  Bottom 0.406: v41.91,19.56 37.47,24 37.47,66.55 44.45,73.53 50.16,73.53 50.8,74.17 50.8,80.52 51.44,81.15 56.52,81.15 57.15,80.52 X303.28
N$100  (via drill 0.4)
  Top 0.406: Q306.3 v41.91,13.21
  Bottom 0.406: v41.91,13.21 36.83,18.29 36.83,67.18 43.81,74.17 47.62,74.17 48.26,74.8 48.26,80.52 50.16,82.42 57.78,82.42 59.69,80.52 X303.30
N$101  (via drill 0.4)
  Top 0.406: Q308.3 v41.91,6.86
  Bottom 0.406: v41.91,6.86 36.2,12.57 36.2,67.82 43.18,74.8 45.09,74.8 45.72,75.44 45.72,80.52 48.9,83.69 59.05,83.69 62.23,80.52 X303.32
N$102
  Top 0.406: D201.2 R201.2
N$103
  Top 0.406: D202.2 R202.2
N$104
  Top 0.406: D203.2 R203.2
N$105
  Top 0.406: D204.2 R204.2
N$106
  Top 0.406: D205.2 R205.2
N$107
  Top 0.406: D206.2 R206.2
N$108
  Top 0.406: D207.2 R207.2
N$109
  Top 0.406: D208.2 R208.2
N$110
  Top 0.406: R209.2 D209.2
N$111
  Top 0.406: R210.2 D210.2
N$112
  Top 0.406: R211.2 D211.2
N$113
  Top 0.406: R212.2 D212.2
N$114
  Top 0.406: R213.2 D213.2
N$115
  Top 0.406: R214.2 D214.2
N$116
  Top 0.406: R215.2 D215.2
N$117
  Top 0.406: R216.2 D216.2
N$118
  Top 0.508: IC101.7 111.69,69.43 C109.1
N$119
  Top 0.254: X101.3 114.3,75.17 R102.1
N$120
  Top 0.406: IC101.5 113.29,69.03 114.3,70.04 114.3,71.63 113.67,72.26 R102.2
N$121
  Top 0.254: X101.2 115.1,75 R101.1
N$122
  Top 0.406: IC101.4 114.09,68.88 114.94,69.72 114.94,71.63 115.57,72.26 R101.2
N$123
  Top 0.406: IC101.9 110.09,68.22 109.22,69.09 109.22,72.16 X101.4
N$124  (via drill 0.4)
  Top 0.406: X101.1 115.9,77.01 116.84,76.07 116.84,71.63 v116.2,70.99 | v111.12,65.28 110.89,65.51 IC101.8
  Top 0.813: X101.1 115.9,79.28 C106.1 115.3,88.41 109.22,94.49 S101.P$2
  Bottom 0.406: v116.2,70.99 116.2,65.91 115.57,65.28 v111.12,65.28
N$125
  Top 0.406: IC101.23 100.26,60.76 99.03,59.53 Q101.3 96.69,61.27 C108.1
N$126
  Top 0.406: IC401.1 29.64,92.58 Q401.2
N$127
  Top 0.406: IC401.2 28.32,93.85 Q401.1
N$128
  Top 0.406: IC101.24 100.73,59.96 97.79,57.02 95.89,57.02 95.08,57.82 Q101.1 92.94,58.33 C103.1
N$129  (via drill 0.4)
  Top 0.406: IC101.2 115.69,68.57 v117.47,70.36 | R105.1 132.08,70.36 v131.44,70.99 132.34,71.88 D101.K
  Bottom 0.406: v117.47,70.36 118.11,70.99 v131.44,70.99
N$130
  Top 0.406: D403.A 25.4,78.61 26.67,77.34 X303.3
N$131  (via drill 0.4)
  Top 0.406: IC401.6 22.86,95.12 v23.5,94.49 | IC402.6 v27.94,90.04 27.94,87.5 33.02,82.42 33.02,78.61 31.75,77.34 X303.7
  Bottom 0.406: v23.5,94.49 v27.94,90.04
N$132  (via drill 0.4)
  Top 0.406: IC401.5 22.86,96.39 v23.5,95.76 | IC402.5 v27.94,91.31 26.67,90.04 26.67,87.5 31.75,82.42 X303.8
  Bottom 0.406: v23.5,95.76 v27.94,91.31
N$133  (via drill 0.4)
  Top 0.406: X405.P$5 16.51,91.31 18.41,89.41 v18.41,77.34 16.51,75.44 X404.P$5
  Bottom 0.406: X402.2 80.01,86.87 X403.P$2 75.56,86.23 41.91,86.23 37.47,81.79 31.11,81.79 29.21,79.88 X303.6 29.21,78.61 27.94,77.34 27.94,76.07 27.3,75.44 21.59,75.44 19.68,77.34 v18.41,77.34
N$134  (via drill 0.4)
  Top 0.406: X405.P$4 19.68,89.41 v19.68,76.07
  Bottom 0.406: X402.1 80.01,81.79 X403.P$1 72.39,85.6 42.55,85.6 38.1,81.15 31.75,81.15 30.48,79.88 30.48,78.61 29.21,77.34 X303.5 29.21,76.07 27.94,74.8 20.95,74.8 v19.68,76.07 17.14,76.07 X404.P$4
N$135  (via drill 0.4)
  Top 0.406: IC101.61 116,63.16 v114.94,62.1
  Bottom 0.406: X103.9 125.73,60.2 116.84,60.2 v114.94,62.1
N$136  (via drill 0.4)
  Top 0.406: IC101.60 116.47,62.36 v114.94,60.83
  Bottom 0.406: X103.10 116.84,58.93 v114.94,60.83
N$137
  Top 0.406: IC101.59 122.46,61.56 123.83,60.2 125.09,60.2 125.73,59.56 125.73,57.66 X103.11
N$138
  Top 0.406: IC101.58 120.08,60.76 X103.12
N$139  (via drill 0.4)
  Top 0.406: IC101.57 113.43,59.96 v112.39,58.93
  Bottom 0.406: X103.13 125.73,52.58 121.92,52.58 120.65,53.85 117.47,53.85 v112.39,58.93
N$140  (via drill 0.4)
  Top 0.406: IC101.56 113.9,59.16 v113.67,58.93
  Bottom 0.406: X103.14 121.92,53.85 121.28,54.48 118.11,54.48 v113.67,58.93
N$141  (via drill 0.4)
  Top 0.406: v120.65,52.58 125.73,52.58 X103.15 | IC101.55 115.64,58.36 v113.67,56.39
  Bottom 0.406: v120.65,52.58 117.47,52.58 v113.67,56.39
N$142  (via drill 0.4)
  Top 0.406: IC101.54 116.11,57.56 v113.67,55.12
  Bottom 0.406: X103.16 117.47,51.31 v113.67,55.12
N$143
  Top 0.406: R106.1 128.27,71.63 129.54,72.9
  Top 0.813: G101.+ 129.54,82.38 129.54,72.9 129.54,69.09 X103.3
N$144  (via drill 0.4)
  Top 0.406: IC101.25 107.55,59.16 v112.39,64.01
  Bottom 0.406: v112.39,64.01 115.57,64.01 116.84,62.74 125.73,62.74 X103.7
N$145  (via drill 0.4)
  Top 0.406: IC101.26 108.02,58.36 v112.39,62.74
  Bottom 0.406: v112.39,62.74 113.03,63.37 114.94,63.37 116.84,61.47 X103.8
N$146  (via drill 0.4)
  Top 0.406: R402.1 34.29,63.74 R401.1 34.29,64.28 v34.29,66.55 | ADC0.1 28.57,72.26 v29.21,72.9
  Bottom 0.406: X303.9 34.29,74.17 | 34.29,74.17 v34.29,66.55 | v29.21,72.9 33.02,72.9 34.29,74.17
N$147  (via drill 0.4)
  Top 0.406: IC101.43 112.49,53.12 v108.58,57.02 | R104.1 135.89,79.49 S102.3 133.64,78.96 v132.72,79.88 | IC101.18 107.83,64.76 v108.58,64.01
  Bottom 0.406: v108.58,57.02 v108.58,64.01 107.31,65.28 107.31,79.25 107.95,79.88 v132.72,79.88
N$148
  Top 0.406: ADC2.1 31.11,72.26 34.29,75.44 35.56,75.44 X303.11
N$149
  Top 0.406: ADC3.1 32.38,72.26 34.92,74.8 36.83,74.8 38.1,76.07 38.1,77.98 X303.12
N$150
  Top 0.406: ADC4.1 33.66,72.26 35.56,74.17 37.47,74.17 39.37,76.07 X303.13
N$151
  Top 0.406: ADC5.1 34.92,72.26 36.2,73.53 38.1,73.53 40.64,76.07 40.64,77.98 X303.14
N$152
  Top 0.406: X303.15 41.91,76.07 38.73,72.9 36.83,72.9 36.2,72.26 ADC6.1
N$153
  Top 0.406: ADC7.1 38.73,71.63 43.18,76.07 43.18,77.98 X303.16
OUT0  (via drill 0.4)
  Top 0.406: IC101.51 114.98,55.16 v113.67,53.85 | v104.78,49.4 102.87,47.5 D209.1
  Bottom 0.406: X103.17 125.73,50.04 117.47,50.04 v113.67,53.85 109.22,53.85 v104.78,49.4
OUT1  (via drill 0.4)
  Top 0.406: IC101.50 117.36,54.36 116.84,53.85 116.84,53.21 117.47,52.58 v117.47,47.5 | v105.41,47.5 102.87,44.96 D210.1
  Bottom 0.406: v105.41,47.5 v117.47,47.5 125.73,47.5 X103.19
OUT2  (via drill 0.4)
  Top 0.406: IC101.49 118.29,45.77 v117.47,44.96 | v105.41,44.96 102.87,42.42 D211.1
  Bottom 0.406: v105.41,44.96 v117.47,44.96 125.73,44.96 X103.21
OUT3  (via drill 0.4)
  Top 0.406: IC101.48 116.49,43.4 v117.47,42.42 | v105.41,42.42 102.87,39.88 D212.1
  Bottom 0.406: v105.41,42.42 v117.47,42.42 125.73,42.42 X103.23
OUT4  (via drill 0.4)
  Top 0.406: IC101.47 115.69,41.66 v117.47,39.88 | v105.41,39.88 102.87,37.34 D213.1
  Bottom 0.406: v105.41,39.88 v117.47,39.88 125.73,39.88 X103.25
OUT5  (via drill 0.4)
  Top 0.406: IC101.46 114.89,39.92 v117.47,37.34 | v105.41,37.34 102.87,34.8 D214.1
  Bottom 0.406: v105.41,37.34 v117.47,37.34 125.73,37.34 X103.27
OUT6  (via drill 0.4)
  Top 0.406: IC101.45 114.09,38.18 v117.47,34.8 | v105.41,34.8 102.87,32.26 D215.1
  Bottom 0.406: v105.41,34.8 v117.47,34.8 125.73,34.8 X103.29
OUT7  (via drill 0.4)
  Top 0.406: IC101.44 113.29,36.44 v117.47,32.26 | v105.41,32.26 102.87,29.72 D216.1
  Bottom 0.406: v105.41,32.26 v117.47,32.26 125.73,32.26 X103.31
RE  (via drill 0.4)
  Top 0.406: IC102.2 126.36,17.02 v127,16.38 | IC101.30 101.01,55.16 v99.69,53.85
  Bottom 0.406: v127,16.38 125.73,15.11 105.41,15.11 98.42,22.1 98.42,52.58 v99.69,53.85
RXD  (via drill 0.4)
  Top 0.406: IC102.1 124.46,17.83 v124.46,12.57 | IC101.27 99.79,57.56 v99.69,57.66
  Bottom 0.406: v124.46,12.57 123.83,13.21 103.5,13.21 96.52,20.19 96.52,54.48 v99.69,57.66
SCK
  Top 0.406: IC101.11 108.49,74.9 106.68,76.71 X102.SCK
TE  (via drill 0.4)
  Top 0.406: IC102.3 127.64,17.02 v128.27,16.38 | IC101.29 100.54,55.96 v99.69,55.12
  Bottom 0.406: v128.27,16.38 126.36,14.48 104.78,14.48 97.79,21.46 97.79,53.21 v99.69,55.12
TXD  (via drill 0.4)
  Top 0.406: IC102.4 128.91,17.02 v129.54,16.38 | IC101.28 100.07,56.76 v99.69,56.39
  Bottom 0.406: v129.54,16.38 127,13.84 104.14,13.84 97.16,20.83 97.16,53.85 v99.69,56.39
USHIELD
  pour Bottom: 113.03,65.91 113.03,73.53 107.95,73.53 107.95,79.25 120.65,79.25 120.65,73.53 115.57,73.53 115.57,65.91
V+
  Top 1.27: D401.A X403.P$3 80.01,91.95 X401.1 | X404.P$2 15.24,79.25 X404.P$1 10.79,83.69 10.79,93.22 X405.P$1 15.24,96.39 X405.P$2
  Bottom 1.27: X404.P$1 15.24,79.25 X404.P$2 21.59,84.33 29.21,84.33 33.66,88.77 73.03,88.77 X403.P$3
V-
  Top 1.27: V401.1 X403.P$4 80.01,97.03 X401.2
  Bottom 1.27: X404.P$8 15.24,71.63 X404.P$7 10.79,76.07 10.79,85.6 X405.P$7 15.24,87.5 X405.P$8 28.57,87.5 33.02,91.95 60.96,91.95 63.5,94.49 | V401.1 63.5,94.49 | 63.5,94.49 V402.2

## Text on the board
tNames: Homelogic | IO Dig AC 230 | Rev 1.0 | Homelogic | CPU USB | Rev 1.0